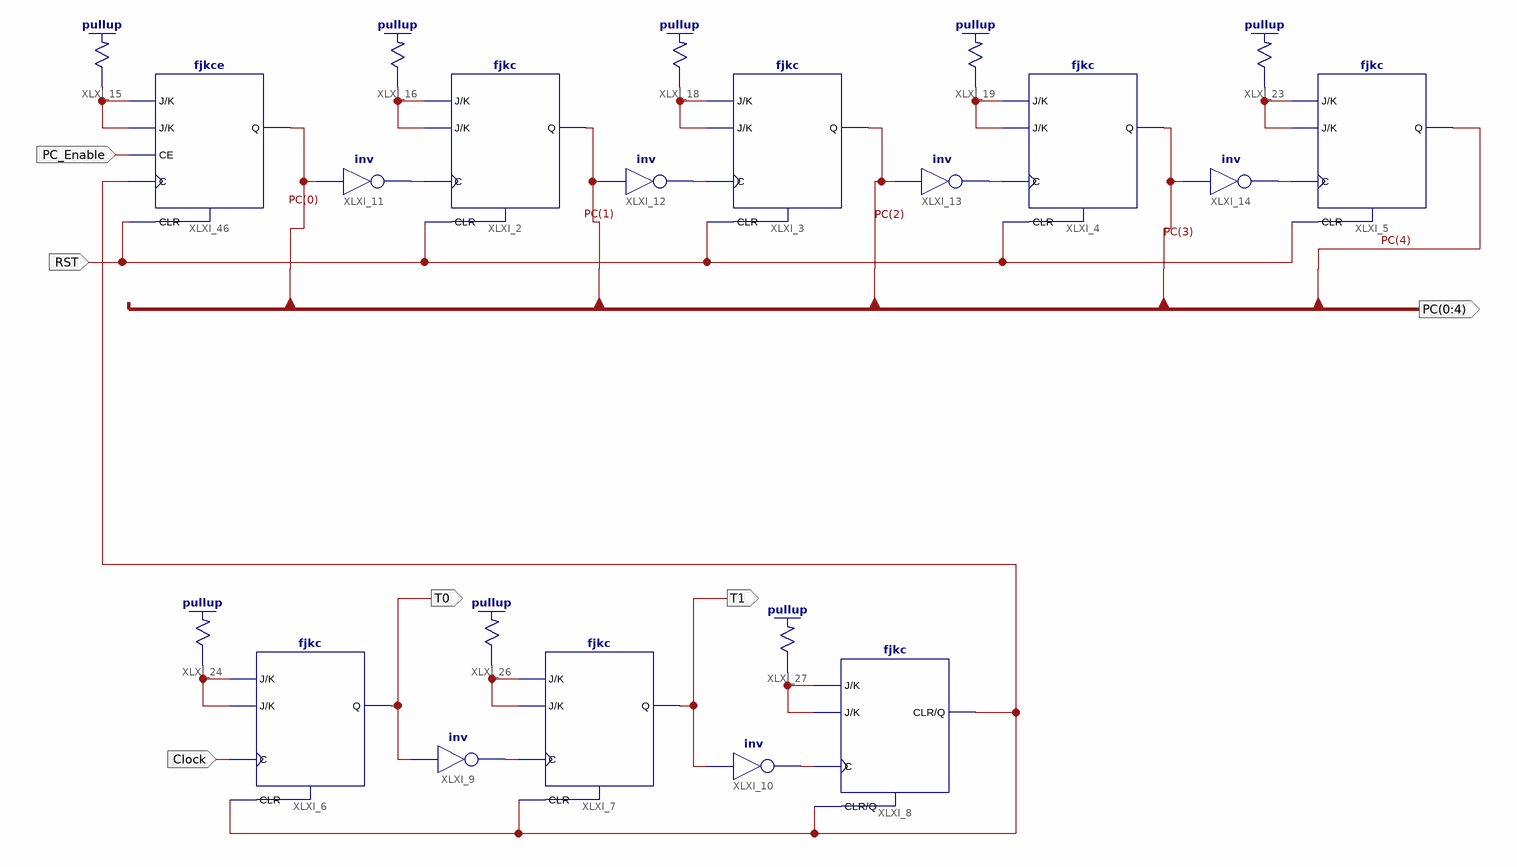
[diagram p0: schematic sheet 1]
// Xilinx ISE schematic program_counter.sch (spartan3e) as structural Verilog: 22 symbols, 6 ports
module program_counter (
  input  Clock,
  input  PC_Enable,
  input  RST,
  output T0,
  output T1,
  output [0:4] PC
);

  wire XLXN_4, XLXN_5, XLXN_8, XLXN_11, XLXN_12, XLXN_14, XLXN_15, XLXN_16, XLXN_18, XLXN_20, XLXN_21,
       XLXN_26, XLXN_27, XLXN_29, XLXN_30;

  fjkc XLXI_6 (.C(Clock), .CLR(XLXN_8), .J(XLXN_27), .K(XLXN_27), .Q(T0));
  fjkc XLXI_7 (.C(XLXN_4), .CLR(XLXN_8), .J(XLXN_29), .K(XLXN_29), .Q(T1));
  fjkc XLXI_8 (.C(XLXN_5), .CLR(XLXN_8), .J(XLXN_30), .K(XLXN_30), .Q(XLXN_8));
  not XLXI_9 (XLXN_4, T0);
  not XLXI_10 (XLXN_5, T1);
  not XLXI_11 (XLXN_11, PC[0]);
  \pullup  XLXI_15 (.O(XLXN_16));
  \pullup  XLXI_16 (.O(XLXN_18));
  \pullup  XLXI_24 (.O(XLXN_27));
  \pullup  XLXI_26 (.O(XLXN_29));
  \pullup  XLXI_27 (.O(XLXN_30));
  not XLXI_14 (XLXN_15, PC[3]);
  \pullup  XLXI_23 (.O(XLXN_26));
  not XLXI_13 (XLXN_14, PC[2]);
  \pullup  XLXI_19 (.O(XLXN_21));
  not XLXI_12 (XLXN_12, PC[1]);
  \pullup  XLXI_18 (.O(XLXN_20));
  fjkc XLXI_5 (.C(XLXN_15), .CLR(RST), .J(XLXN_26), .K(XLXN_26), .Q(PC[4]));
  fjkc XLXI_4 (.C(XLXN_14), .CLR(RST), .J(XLXN_21), .K(XLXN_21), .Q(PC[3]));
  fjkc XLXI_3 (.C(XLXN_12), .CLR(RST), .J(XLXN_20), .K(XLXN_20), .Q(PC[2]));
  fjkc XLXI_2 (.C(XLXN_11), .CLR(RST), .J(XLXN_18), .K(XLXN_18), .Q(PC[1]));
  fjkce XLXI_46 (.C(XLXN_8), .CE(PC_Enable), .CLR(RST), .J(XLXN_16), .K(XLXN_16), .Q(PC[0]));
endmodule
